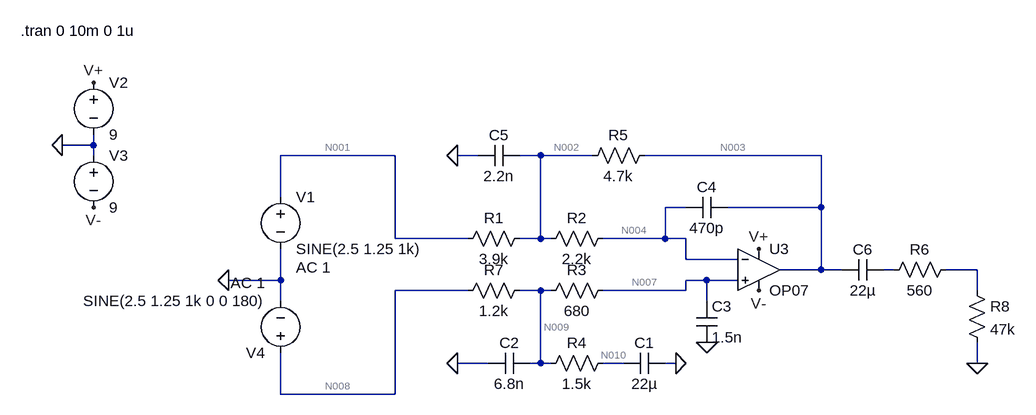
[diagram p0: schematic Output_Buffer.asc]
Output_Buffer.asc, the LTspice schematic file:
Version 4
SHEET 1 2048 680
WIRE -208 80 -208 64
WIRE -208 80 -256 80
WIRE -208 96 -208 80
WIRE 256 96 80 96
WIRE 384 96 352 96
WIRE 480 96 448 96
WIRE 560 96 480 96
WIRE 912 96 640 96
WIRE 80 160 80 96
WIRE 704 176 672 176
WIRE 912 176 912 96
WIRE 912 176 768 176
WIRE 256 224 256 96
WIRE 368 224 256 224
WIRE 480 224 480 96
WIRE 480 224 448 224
WIRE 496 224 480 224
WIRE 672 224 672 176
WIRE 672 224 576 224
WIRE 704 224 672 224
WIRE 704 256 704 224
WIRE 784 256 704 256
WIRE 912 272 912 176
WIRE 912 272 848 272
WIRE 944 272 912 272
WIRE 1024 272 1008 272
WIRE 1152 272 1104 272
WIRE 80 288 80 240
WIRE 80 288 0 288
WIRE 736 288 704 288
WIRE 784 288 736 288
WIRE 368 304 256 304
WIRE 480 304 448 304
WIRE 496 304 480 304
WIRE 704 304 704 288
WIRE 704 304 576 304
WIRE 1152 304 1152 272
WIRE 80 320 80 288
WIRE 736 320 736 288
WIRE 400 416 352 416
WIRE 480 416 480 304
WIRE 480 416 464 416
WIRE 496 416 480 416
WIRE 608 416 576 416
WIRE 688 416 672 416
WIRE 1152 416 1152 384
WIRE 80 464 80 400
WIRE 256 464 256 304
WIRE 256 464 80 464
FLAG -208 -16 V+
FLAG -208 176 V-
FLAG -256 80 0
FLAG 816 240 V+
FLAG 816 304 V-
FLAG 0 288 0
FLAG 688 416 0
FLAG 352 416 0
FLAG 736 384 0
FLAG 352 96 0
FLAG 1152 416 0
SYMBOL voltage 80 144 R0
WINDOW 123 24 124 Left 2
WINDOW 39 0 0 Left 0
SYMATTR Value2 AC 1
SYMATTR InstName V1
SYMATTR Value SINE(2.5 1.25 1k)
SYMBOL voltage -208 -32 R0
WINDOW 123 0 0 Left 0
WINDOW 39 0 0 Left 0
SYMATTR InstName V2
SYMATTR Value 9
SYMBOL voltage -208 80 R0
WINDOW 123 0 0 Left 0
WINDOW 39 0 0 Left 0
SYMATTR InstName V3
SYMATTR Value 9
SYMBOL res 464 208 R90
WINDOW 0 0 56 VBottom 2
WINDOW 3 32 56 VTop 2
SYMATTR InstName R1
SYMATTR Value 3.9k
SYMBOL res 464 288 R90
WINDOW 0 0 56 VBottom 2
WINDOW 3 32 56 VTop 2
SYMATTR InstName R7
SYMATTR Value 1.2k
SYMBOL OpAmps\\OP07 816 208 R0
SYMATTR InstName U3
SYMBOL res 592 208 R90
WINDOW 0 0 56 VBottom 2
WINDOW 3 32 56 VTop 2
SYMATTR InstName R2
SYMATTR Value 2.2k
SYMBOL res 592 288 R90
WINDOW 0 0 56 VBottom 2
WINDOW 3 32 56 VTop 2
SYMATTR InstName R3
SYMATTR Value 680
SYMBOL voltage 80 416 R180
WINDOW 123 24 124 Left 2
WINDOW 39 0 0 Left 0
SYMATTR Value2 AC 1
SYMATTR InstName V4
SYMATTR Value SINE(2.5 1.25 1k 0 0 180)
SYMBOL res 592 400 R90
WINDOW 0 0 56 VBottom 2
WINDOW 3 32 56 VTop 2
SYMATTR InstName R4
SYMATTR Value 1.5k
SYMBOL cap 672 400 R90
WINDOW 0 0 32 VBottom 2
WINDOW 3 32 32 VTop 2
SYMATTR InstName C1
SYMATTR Value 22µ
SYMBOL cap 464 400 R90
WINDOW 0 0 32 VBottom 2
WINDOW 3 32 32 VTop 2
SYMATTR InstName C2
SYMATTR Value 6.8n
SYMBOL cap 720 320 R0
SYMATTR InstName C3
SYMATTR Value 1.5n
SYMBOL cap 768 160 R90
WINDOW 0 0 32 VBottom 2
WINDOW 3 32 32 VTop 2
SYMATTR InstName C4
SYMATTR Value 470p
SYMBOL res 656 80 R90
WINDOW 0 0 56 VBottom 2
WINDOW 3 32 56 VTop 2
SYMATTR InstName R5
SYMATTR Value 4.7k
SYMBOL cap 448 80 R90
WINDOW 0 0 32 VBottom 2
WINDOW 3 32 32 VTop 2
SYMATTR InstName C5
SYMATTR Value 2.2n
SYMBOL cap 1008 256 R90
WINDOW 0 0 32 VBottom 2
WINDOW 3 32 32 VTop 2
SYMATTR InstName C6
SYMATTR Value 22µ
SYMBOL res 1120 256 R90
WINDOW 0 0 56 VBottom 2
WINDOW 3 32 56 VTop 2
SYMATTR InstName R6
SYMATTR Value 560
SYMBOL res 1136 288 R0
SYMATTR InstName R8
SYMATTR Value 47k
TEXT -320 -96 Left 2 !.tran 0 10m 0 1u

The netlist it stands for:
* Output_Buffer.asc
V1 N001 0 SINE(2.5 1.25 1k) AC 1
V2 V+ 0 9
V3 0 V- 9
R1 N002 N001 3.9k
R7 N009 N008 1.2k
XU3 N007 N004 V+ V- N003 LT1001  ; OP07, pins In+ In- V+ V- OUT
R2 N004 N002 2.2k
R3 N007 N009 680
V4 N008 0 SINE(2.5 1.25 1k 0 0 180) AC 1
R4 N010 N009 1.5k
C1 0 N010 22µ
C2 N009 0 6.8n
C3 N007 0 1.5n
C4 N003 N004 470p
R5 N003 N002 4.7k
C5 N002 0 2.2n
C6 N005 N003 22µ
R6 N006 N005 560
R8 N006 0 47k
.tran 0 10m 0 1u
.lib LTC.lib
.backanno
.end

* Results of the author's LTspice run, read from the files saved beside the schematic
* Operating Point, zero values left out:
*   V(n001) = 2.5 V
*   V(v+) = 9 V
*   V(v-) = -9 V
*   V(n002) = 2.5 V
*   V(n009) = 2.5 V
*   V(n008) = 2.5 V
*   V(n004) = 2.5 V
*   V(n007) = 2.5 V
*   V(n003) = 2.5 V
*   V(n010) = 2.5 V
*   I(R5) = -854.1 pA
*   I(R3) = -4.51 pA
*   I(R2) = -4.419 pA
*   I(R7) = -4.51 pA
*   I(R1) = -858.6 pA
*   I(V4) = -4.51 pA
*   I(V3) = -2.25 mA
*   I(V2) = -2.25 mA
*   I(V1) = -858.6 pA
*   Ix(u3:1) = 4.51 pA
*   Ix(u3:2) = 4.419 pA
*   Ix(u3:3) = 2.25 mA
*   Ix(u3:4) = -2.25 mA
*   Ix(u3:5) = 849.1 pA
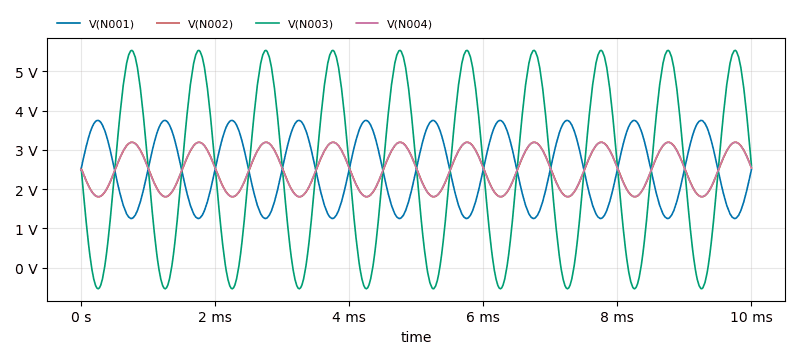
[diagram p1: Transient Analysis of Output_Buffer.asc, plotted from the saved traces]
* Transient Analysis, 1 run:
*   V(N001): min 1.252 V, max 3.75 V, average 2.501 V, rms 2.653 V, last 2.5 V
*   V(N002): min 1.804 V, max 3.193 V, average 2.498 V, rms 2.546 V, last 2.548 V
*   V(N003): min -541 mV, max 5.534 V, average 2.494 V, rms 3.292 V, last 2.592 V
*   V(N004): min 1.805 V, max 3.193 V, average 2.498 V, rms 2.546 V, last 2.532 V